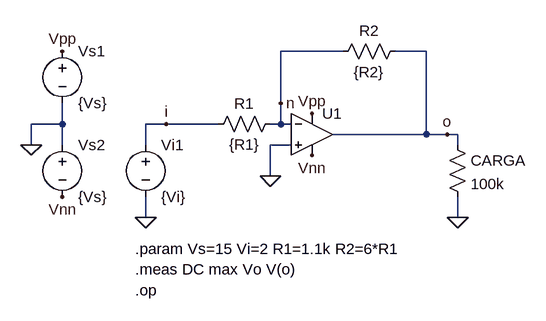
[diagram p0: schematic ex1a.asc]
ex1a.asc, the LTspice schematic file:
Version 4
SHEET 1 880 680
WIRE 256 -32 160 -32
WIRE 384 -32 336 -32
WIRE 160 48 160 -32
WIRE -176 80 -176 48
WIRE -176 80 -224 80
WIRE -16 80 -48 80
WIRE 64 80 -16 80
WIRE 160 80 160 48
WIRE 160 80 144 80
WIRE 176 80 160 80
WIRE 384 96 384 -32
WIRE 384 96 240 96
WIRE 416 96 384 96
WIRE 432 96 416 96
WIRE -224 112 -224 80
WIRE -176 112 -176 80
WIRE -48 112 -48 80
WIRE 176 112 144 112
WIRE 432 112 432 96
WIRE 144 160 144 112
WIRE -48 224 -48 192
WIRE 432 224 432 192
FLAG 144 160 0
FLAG -48 224 0
FLAG 432 224 0
FLAG -224 112 0
FLAG -176 -32 Vpp
FLAG -176 192 Vnn
FLAG 416 96 o
FLAG -16 80 i
FLAG 208 64 Vpp
FLAG 208 128 Vnn
FLAG 160 48 n
SYMBOL voltage -48 96 R0
SYMATTR InstName Vi1
SYMATTR Value {Vi}
SYMBOL res 160 64 R90
WINDOW 0 0 56 VBottom 2
WINDOW 3 32 56 VTop 2
SYMATTR InstName R1
SYMATTR Value {R1}
SYMBOL res 352 -48 R90
WINDOW 0 0 56 VBottom 2
WINDOW 3 32 56 VTop 2
SYMATTR InstName R2
SYMATTR Value {R2}
SYMBOL OpAmps\\UniversalOpAmp2 208 96 R0
SYMATTR InstName U1
SYMATTR Value2 Avol=125 GBW=10Meg Slew=10Meg
SYMBOL voltage -176 -48 R0
SYMATTR InstName Vs1
SYMATTR Value {Vs}
SYMBOL voltage -176 96 R0
SYMATTR InstName Vs2
SYMATTR Value {Vs}
SYMBOL res 416 96 R0
SYMATTR InstName CARGA
SYMATTR Value 100k
TEXT -64 272 Left 2 !.param Vs=15 Vi=2 R1=1.1k R2=6*R1
TEXT -64 336 Left 2 !.op
TEXT -64 304 Left 2 !.meas DC max Vo V(o)

The netlist it stands for:
* ex1a.asc
Vi1 i 0 {Vi}
R1 n i {R1}
R2 o n {R2}
XU1 0 n Vpp Vnn o level2 Avol=125 GBW=10Meg Slew=10Meg Ilimit=25m Rail=0 Vos=0 En=0 Enk=0 In=0 Ink=0 Rin=500Meg  ; pins In+ In- V+ V- OUT
Vs1 Vpp 0 {Vs}
Vs2 0 Vnn {Vs}
R§CARGA o 0 100k
.param Vs=15 Vi=2 R1=1.1k R2=6*R1
.op
.meas DC max Vo V(o)
.lib UniversalOpAmp2.lib
.backanno
.end

* Results of the author's LTspice run, read from the files saved beside the schematic
* Operating Point:
*   V(i) = 2 V
*   V(n) = 102.9 mV
*   V(o) = -11.28 V
*   V(vpp) = 15 V
*   V(vnn) = -15 V
*   I(R1) = -1.725 mA
*   I(R2) = -1.725 mA
*   I(Carga) = -112.8 µA
*   I(Vi1) = -1.725 mA
*   I(Vs1) = -430.1 µA
*   I(Vs2) = -2.267 mA
*   Ix(u1:1) = 0 A
*   Ix(u1:2) = 205.8 pA
*   Ix(u1:3) = 430.1 µA
*   Ix(u1:4) = -2.267 mA
*   Ix(u1:5) = 1.837 mA
* From the log:
*   Semiconductor Device Operating Points:
*                           --- Diodes ---
*   Name:    d:u1:1      d:u1:2
*   Model:    u1:x        u1:x
*   Id:     -2.63e-11   -3.72e-12
*   Vd:     -2.63e+01   -3.72e+00
*   Req:     1.00e-12    1.00e-12
*   CAP:     0.00e+00    0.00e+00